# EasyEDA schematic sch.json
TITLE: Sheet_1; REV: 1.0; Date: 2024-01-06; Sheet: 1/1; Drawn By: firseve; Company: Your Company
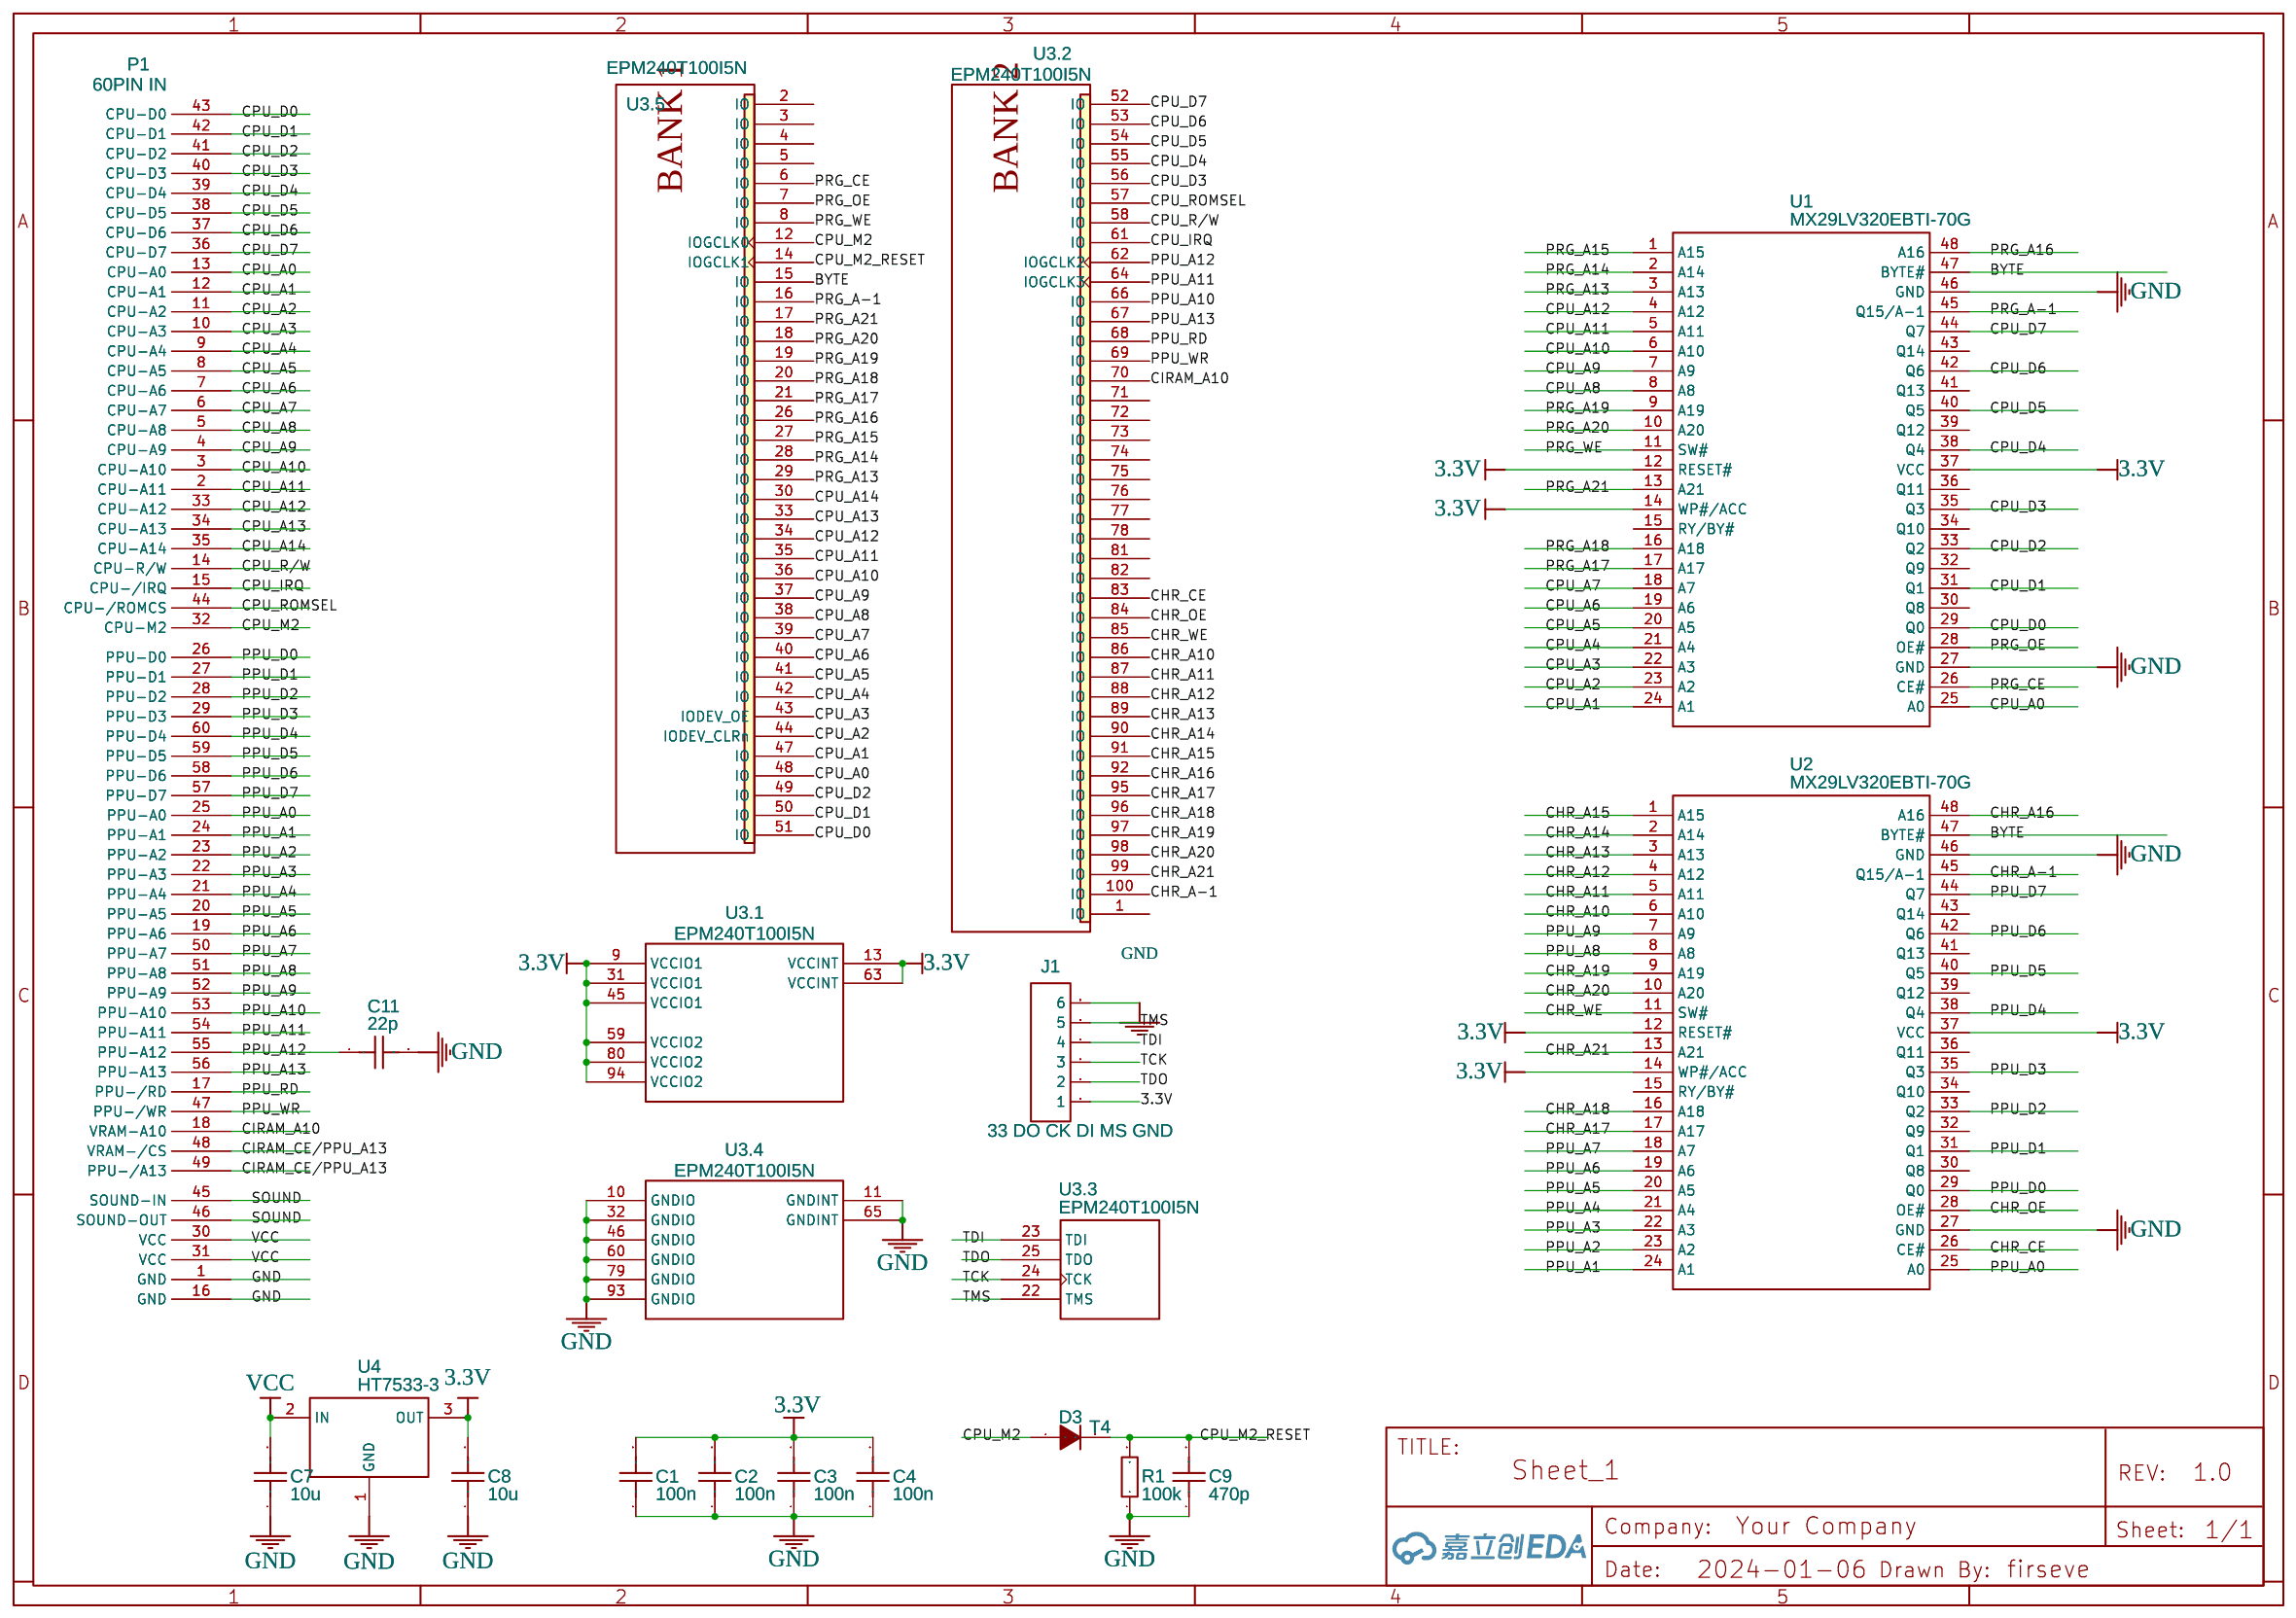
[diagram p0: schematic sheet]

## Parts
C1  100n  [C0805]
C2  100n  [C0805]
C3  100n  [C0805]
C4  100n  [C0805]
C7  10u  [C1206]
C8  10u  [C1206]
C9  470p  [C0805]
C11  22p  [C0805]
D3  T4  [SOD-123]
J1  33 DO CK DI MS GND  [HDR-M-2.54_1X6]
P1  60PIN IN  [60PIN-IN(小霸王游戏机总线插槽60FC)]
R1  100k  [R0805]
U1  MX29LV320EBTI-70G  [TSOP-48_L12.0-W18.4-P0.50-LS20.0-TL]
U2  MX29LV320EBTI-70G  [TSOP-48_L12.0-W18.4-P0.50-LS20.0-TL]
U3  EPM240T100I5N  [TQFP-100_L14.0-W14.0-P0.50-LS16.0-BL]  (sections 1,2,3,4,5)
U4  HT7533-3  [SOT-89_L4.5-W2.5-P1.50-LS4.2-BR]

## Library data of the parts
C1-C4 = CL21B104KBCNNWC: Supplier: LCSC; Supplier Part: C3901446; Manufacturer: SAMSUNG(三星); Contributor: lcsc
C7 C8 = C3216X7R1V106M160AE_C3904719: Contributor: lcsc; Supplier: LCSC; Supplier Part: C3904719; Manufacturer: TDK; Manufacturer Part: C3216X7R1V106M160AE
C9 = TCC0805X7R471K251FT: Contributor: LCSC; Supplier: LCSC; Supplier Part: C376982; Manufacturer: CCTC(三环); JLCPCB Part Class: Extended Part
C11 = 08055J220FBTTR: Supplier: LCSC; Supplier Part: C6031695; Manufacturer: Kyocera AVX; JLCPCB Part Class: Extended Part; Contributor: lcsc
D3 = T4: Supplier: LCSC; Manufacturer: HT; Manufacturer Part: 1N4148W; Contributor: dhx233; Supplier Part: C179717
J1 = HDR-M-2.54_1x6: Supplier Part: C190819; Supplier: LCSC; Contributor: LCEDA_Lib
P1 = FC CART: Contributor: 401567A
R1 = TC0510F1003T5E: Contributor: LCSC; Supplier: LCSC; Supplier Part: C68808; Manufacturer: UNI-ROYAL(厚声); JLCPCB Part Class: Extended Part
U1 U2 = MX29LV640EBTI-70G: Supplier: LCSC; Manufacturer: MXIC(旺宏电子); Supplier Part: C30076; JLCPCB Part Class: Extended Part
U3 = EPM240T100I5N: subpart_no: 1; Supplier Part: C40067; Supplier: LCSC; Manufacturer: Intel/Altera; JLCPCB Part Class: Extended Part
U4 = HT7533-3: Supplier: LCSC; Manufacturer: HOLTEK(合泰/盛群); Supplier Part: C66271; JLCPCB Part Class: Extended Part

## Nets
3.3V: C1.2 C2.2 C3.2 C4.2 C8.2 J1.1 U1.12(RESET#) U1.14(WP#/ACC) U1.37(VCC) U2.12(RESET#) U2.14(WP#/ACC) U2.37(VCC) U3.9(VCCIO1) U3.13(VCCINT) U3.31(VCCIO1) U3.45(VCCIO1) U3.59(VCCIO2) U3.63(VCCINT) U3.80(VCCIO2) U3.94(VCCIO2) U4.3(OUT)
GND: C1.1 C2.1 C3.1 C4.1 C7.1 C8.1 C9.1 C11.2 J1.6 P1.1(GND) P1.16(GND) R1.1 U1.27(GND) U1.46(GND) U2.27(GND) U2.46(GND) U3.10(GNDIO) U3.11(GNDINT) U3.32(GNDIO) U3.46(GNDIO) U3.60(GNDIO) U3.65(GNDINT) U3.79(GNDIO) U3.93(GNDIO) U4.1(GND)
VCC: C7.2 P1.30(VCC) P1.31(VCC) U4.2(IN)
BYTE: U1.47(BYTE#) U2.47(BYTE#) U3.15(IO)
CHR_A10: U2.6(A10) U3.86(IO)
CHR_A11: U2.5(A11) U3.87(IO)
CHR_A12: U2.4(A12) U3.88(IO)
CHR_A13: U2.3(A13) U3.89(IO)
CHR_A14: U2.2(A14) U3.90(IO)
CHR_A15: U2.1(A15) U3.91(IO)
CHR_A16: U2.48(A16) U3.92(IO)
CHR_A17: U2.17(A17) U3.95(IO)
CHR_A18: U2.16(A18) U3.96(IO)
CHR_A19: U2.9(A19) U3.97(IO)
CHR_A20: U2.10(A20) U3.98(IO)
CHR_A21: U2.13(A21) U3.99(IO)
CHR_A-1: U2.45(Q15/A-1) U3.100(IO)
CHR_CE: U2.26(CE#) U3.83(IO)
CHR_OE: U2.28(OE#) U3.84(IO)
CHR_WE: U2.11(SW#) U3.85(IO)
CIRAM_A10: P1.18(VRAM-A10) U3.70(IO)
CIRAM_CE/PPU_A13: P1.48(VRAM-/CS) P1.49(PPU-/A13)
CPU_A0: P1.13(CPU-A0) U1.25(A0) U3.48(IO)
CPU_A1: P1.12(CPU-A1) U1.24(A1) U3.47(IO)
CPU_A2: P1.11(CPU-A2) U1.23(A2) U3.44(IODEV_CLRn)
CPU_A3: P1.10(CPU-A3) U1.22(A3) U3.43(IODEV_OE)
CPU_A4: P1.9(CPU-A4) U1.21(A4) U3.42(IO)
CPU_A5: P1.8(CPU-A5) U1.20(A5) U3.41(IO)
CPU_A6: P1.7(CPU-A6) U1.19(A6) U3.40(IO)
CPU_A7: P1.6(CPU-A7) U1.18(A7) U3.39(IO)
CPU_A8: P1.5(CPU-A8) U1.8(A8) U3.38(IO)
CPU_A9: P1.4(CPU-A9) U1.7(A9) U3.37(IO)
CPU_A10: P1.3(CPU-A10) U1.6(A10) U3.36(IO)
CPU_A11: P1.2(CPU-A11) U1.5(A11) U3.35(IO)
CPU_A12: P1.33(CPU-A12) U1.4(A12) U3.34(IO)
CPU_A13: P1.34(CPU-A13) U3.33(IO)
CPU_A14: P1.35(CPU-A14) U3.30(IO)
CPU_D0: P1.43(CPU-D0) U1.29(Q0) U3.51(IO)
CPU_D1: P1.42(CPU-D1) U1.31(Q1) U3.50(IO)
CPU_D2: P1.41(CPU-D2) U1.33(Q2) U3.49(IO)
CPU_D3: P1.40(CPU-D3) U1.35(Q3) U3.56(IO)
CPU_D4: P1.39(CPU-D4) U1.38(Q4) U3.55(IO)
CPU_D5: P1.38(CPU-D5) U1.40(Q5) U3.54(IO)
CPU_D6: P1.37(CPU-D6) U1.42(Q6) U3.53(IO)
CPU_D7: P1.36(CPU-D7) U1.44(Q7) U3.52(IO)
CPU_IRQ: P1.15(CPU-/IRQ) U3.61(IO)
CPU_M2: D3.1(A) P1.32(CPU-M2) U3.12(IOGCLK0)
CPU_M2_RESET: C9.2 D3.2(K) R1.2 U3.14(IOGCLK1)
CPU_R/W: P1.14(CPU-R/W) U3.58(IO)
CPU_ROMSEL: P1.44(CPU-/ROMCS) U3.57(IO)
PPU_A0: P1.25(PPU-A0) U2.25(A0)
PPU_A1: P1.24(PPU-A1) U2.24(A1)
PPU_A2: P1.23(PPU-A2) U2.23(A2)
PPU_A3: P1.22(PPU-A3) U2.22(A3)
PPU_A4: P1.21(PPU-A4) U2.21(A4)
PPU_A5: P1.20(PPU-A5) U2.20(A5)
PPU_A6: P1.19(PPU-A6) U2.19(A6)
PPU_A7: P1.50(PPU-A7) U2.18(A7)
PPU_A8: P1.51(PPU-A8) U2.8(A8)
PPU_A9: P1.52(PPU-A9) U2.7(A9)
PPU_A10: P1.53(PPU-A10) U3.66(IO)
PPU_A11: P1.54(PPU-A11) U3.64(IOGCLK3)
PPU_A12: C11.1 P1.55(PPU-A12) U3.62(IOGCLK2)
PPU_A13: P1.56(PPU-A13) U3.67(IO)
PPU_D0: P1.26(PPU-D0) U2.29(Q0)
PPU_D1: P1.27(PPU-D1) U2.31(Q1)
PPU_D2: P1.28(PPU-D2) U2.33(Q2)
PPU_D3: P1.29(PPU-D3) U2.35(Q3)
PPU_D4: P1.60(PPU-D4) U2.38(Q4)
PPU_D5: P1.59(PPU-D5) U2.40(Q5)
PPU_D6: P1.58(PPU-D6) U2.42(Q6)
PPU_D7: P1.57(PPU-D7) U2.44(Q7)
PPU_RD: P1.17(PPU-/RD) U3.68(IO)
PPU_WR: P1.47(PPU-/WR) U3.69(IO)
PRG_A13: U1.3(A13) U3.29(IO)
PRG_A14: U1.2(A14) U3.28(IO)
PRG_A15: U1.1(A15) U3.27(IO)
PRG_A16: U1.48(A16) U3.26(IO)
PRG_A17: U1.17(A17) U3.21(IO)
PRG_A18: U1.16(A18) U3.20(IO)
PRG_A19: U1.9(A19) U3.19(IO)
PRG_A20: U1.10(A20) U3.18(IO)
PRG_A21: U1.13(A21) U3.17(IO)
PRG_A-1: U1.45(Q15/A-1) U3.16(IO)
PRG_CE: U1.26(CE#) U3.6(IO)
PRG_OE: U1.28(OE#) U3.7(IO)
PRG_WE: U1.11(SW#) U3.8(IO)
SOUND: P1.45(SOUND-IN) P1.46(SOUND-OUT)
TCK: J1.3 U3.24(TCK)
TDI: J1.4 U3.23(TDI)
TDO: J1.2 U3.25(TDO)
TMS: J1.5 U3.22(TMS)

Not connected (* = marked no-connect by the designer): U1 15(RY/BY#) 30(Q8) 32(Q9) 34(Q10) 36(Q11) 39(Q12) 41(Q13) 43(Q14); U2 15(RY/BY#) 30(Q8) 32(Q9) 34(Q10) 36(Q11) 39(Q12) 41(Q13) 43(Q14); U3 1(IO) 2(IO) 3(IO) 4(IO) 5(IO) 71(IO) 72(IO) 73(IO) 74(IO) 75(IO) 76(IO) 77(IO) 78(IO) 81(IO) 82(IO)
